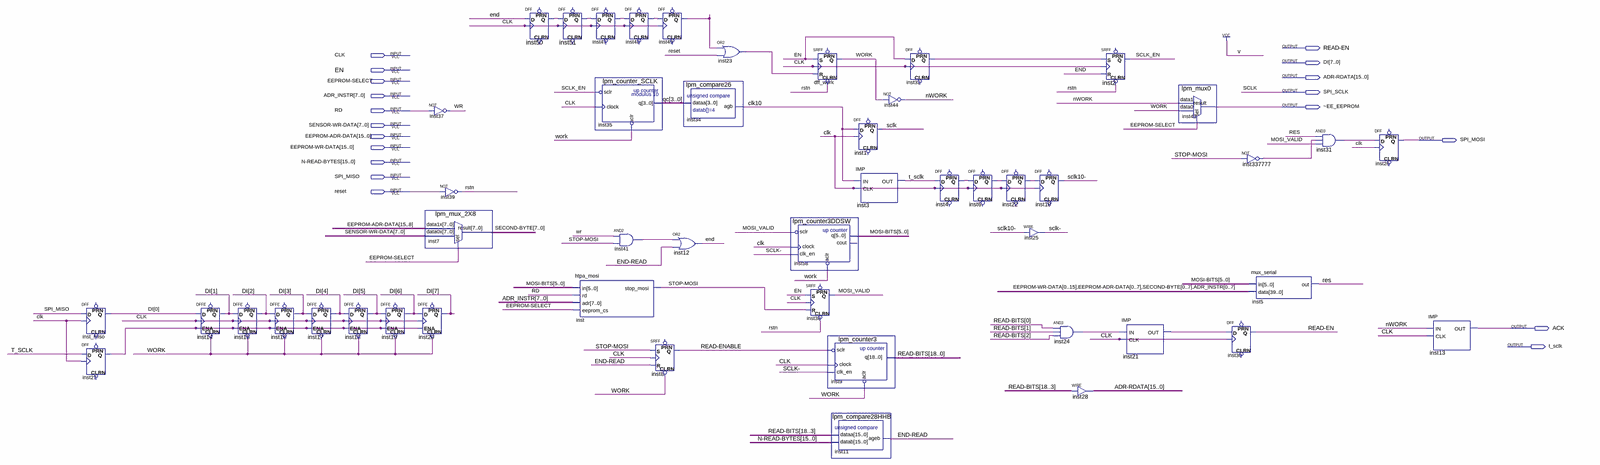
[diagram p0: schematic sheet, whole]
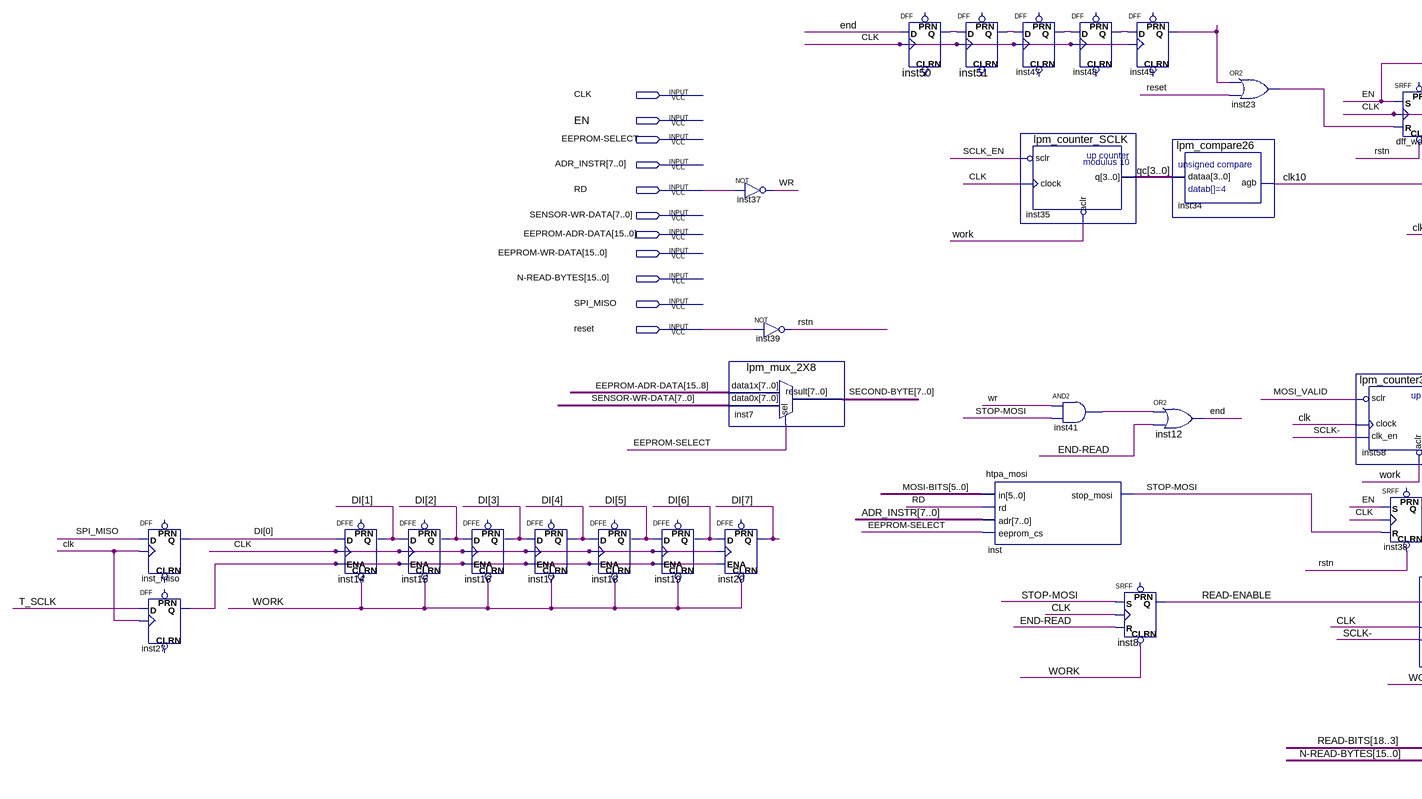
[diagram p1: schematic sheet, left part]
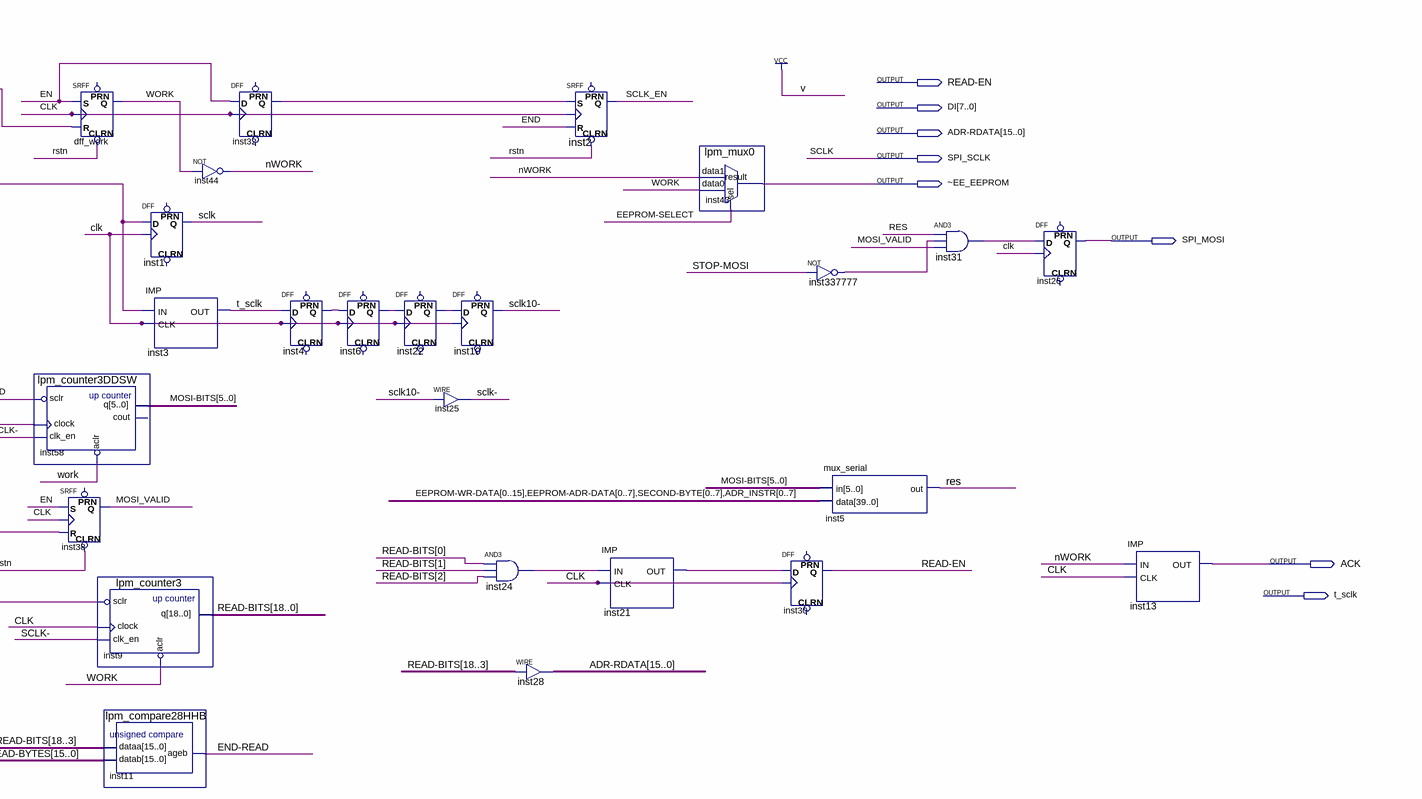
[diagram p2: schematic sheet, right part]
// Quartus schematic HTPA80x64d.bdf as structural Verilog: 49 symbols, 19 pins
module HTPA80x64d (
  input  CLK,
  input  EN,
  input  \EEPROM-SELECT ,
  input  [7:0] ADR_INSTR,
  input  RD,
  input  [7:0] \SENSOR-WR-DATA ,
  input  [15:0] \EEPROM-ADR-DATA ,
  input  [15:0] \EEPROM-WR-DATA ,
  input  [15:0] \N-READ-BYTES ,
  input  SPI_MISO,
  input  reset,
  output \READ-EN ,
  output [7:0] DI,
  output [15:0] \ADR-RDATA ,
  output SPI_SCLK,
  output \~EE_EEPROM ,
  output SPI_MOSI,
  output ACK,
  output t_sclk
);

  wire clk10, \end , \END-READ , inst4_q, inst6_q, inst21_out, inst22_q, inst23_out, inst24_out, inst27_q,
       inst31_out, inst32_q, inst41_out, inst47_q, inst48_q, inst49_q, inst50_q, inst51_q, inst337777_out,
       MOSI_VALID, nWORK, \READ-ENABLE , RES, rstn, \sclk10- , \SCLK- , SCLK_EN, \STOP-MOSI , WORK, wr;
  wire [3:0] qc;
  wire [5:0] \MOSI-BITS ;
  wire [7:0] \SECOND-BYTE ;
  wire [18:0] \READ-BITS ;

  DFF inst_miso (.CLK(CLK), .D(SPI_MISO), .Q(DI[0]));  // open: CLRN, PRN
  DFF inst27 (.CLK(CLK), .D(t_sclk), .Q(inst27_q));  // open: CLRN, PRN
  DFFE inst14 (.CLRN(WORK), .D(DI[0]), .CLK(CLK), .ENA(inst27_q), .Q(DI[1]));  // open: PRN
  DFFE inst15 (.CLRN(WORK), .D(DI[1]), .CLK(CLK), .ENA(inst27_q), .Q(DI[2]));  // open: PRN
  DFFE inst16 (.CLRN(WORK), .D(DI[2]), .CLK(CLK), .ENA(inst27_q), .Q(DI[3]));  // open: PRN
  DFFE inst17 (.CLRN(WORK), .D(DI[3]), .CLK(CLK), .ENA(inst27_q), .Q(DI[4]));  // open: PRN
  DFFE inst18 (.CLRN(WORK), .D(DI[4]), .CLK(CLK), .ENA(inst27_q), .Q(DI[5]));  // open: PRN
  DFFE inst19 (.CLRN(WORK), .D(DI[5]), .CLK(CLK), .ENA(inst27_q), .Q(DI[6]));  // open: PRN
  lpm_mux_2X8 inst7 (
    .data1x(\EEPROM-ADR-DATA [15:8]), .data0x(\SENSOR-WR-DATA ), .sel(\EEPROM-SELECT ), .result(\SECOND-BYTE ));
  DFFE inst20 (.CLRN(WORK), .D(DI[6]), .CLK(CLK), .ENA(inst27_q), .Q(DI[7]));  // open: PRN
  not inst37 (wr, RD);
  not inst39 (rstn, reset);
  DFF inst50 (.CLK(CLK), .D(\end ), .Q(inst50_q));  // open: CLRN, PRN
  DFF inst51 (.CLK(CLK), .D(inst50_q), .Q(inst51_q));  // open: CLRN, PRN
  htpa_mosi inst (.in(\MOSI-BITS ), .rd(RD), .adr(ADR_INSTR), .eeprom_cs(\EEPROM-SELECT ), .stop_mosi(\STOP-MOSI ));
  DFF inst47 (.CLK(CLK), .D(inst51_q), .Q(inst47_q));  // open: CLRN, PRN
  lpm_counter_SCLK inst35 (.sclr(~SCLK_EN), .clock(CLK), .aclr(~WORK), .q(qc));
  DFF inst48 (.CLK(CLK), .D(inst47_q), .Q(inst48_q));  // open: CLRN, PRN
  and inst41 (inst41_out, wr, \STOP-MOSI );
  DFF inst49 (.CLK(CLK), .D(inst48_q), .Q(inst49_q));  // open: CLRN, PRN
  SRFF inst8 (.CLRN(WORK), .S(\STOP-MOSI ), .R(\END-READ ), .CLK(CLK), .Q(\READ-ENABLE ));  // open: PRN
  lpm_compare26 inst34 (.dataa(qc), .agb(clk10));
  or inst12 (\end , inst41_out, \END-READ );
  or inst23 (inst23_out, inst49_q, reset);
  lpm_counter3DDSW inst58 (
    .sclr(~MOSI_VALID), .clock(CLK), .clk_en(\SCLK- ), .aclr(~WORK), .q(\MOSI-BITS ));  // open: cout
  SRFF inst38 (.CLRN(rstn), .S(EN), .R(\STOP-MOSI ), .CLK(CLK), .Q(MOSI_VALID));  // open: PRN
  SRFF dff_work (.CLRN(rstn), .S(EN), .R(inst23_out), .CLK(CLK), .Q(WORK));  // open: PRN
  lpm_counter3 inst9 (.sclr(~\READ-ENABLE ), .clock(CLK), .clk_en(\SCLK- ), .aclr(~WORK), .q(\READ-BITS ));
  lpm_compare28HHB inst11 (.dataa(\READ-BITS [18:3]), .datab(\N-READ-BYTES ), .ageb(\END-READ ));
  DFF inst1 (.CLK(CLK), .D(clk10), .Q(SPI_SCLK));  // open: CLRN, PRN
  IMP inst3 (.IN(clk10), .CLK(CLK), .OUT(t_sclk));
  not inst44 (nWORK, WORK);
  DFF inst32 (.CLK(CLK), .D(EN), .Q(inst32_q));  // open: CLRN, PRN
  DFF inst4 (.CLK(CLK), .D(t_sclk), .Q(inst4_q));  // open: CLRN, PRN
  DFF inst6 (.CLK(CLK), .D(inst4_q), .Q(inst6_q));  // open: CLRN, PRN
  DFF inst22 (.CLK(CLK), .D(inst6_q), .Q(inst22_q));  // open: CLRN, PRN
  DFF inst10 (.CLK(CLK), .D(inst22_q), .Q(\sclk10- ));  // open: CLRN, PRN
  assign \SCLK-  = \sclk10- ;  // WIRE inst25
  and inst24 (inst24_out, \READ-BITS [0], \READ-BITS [1], \READ-BITS [2]);
  assign \ADR-RDATA  = \READ-BITS [18:3];  // WIRE inst28
  SRFF inst2 (.CLRN(rstn), .S(inst32_q), .R(\end ), .CLK(CLK), .Q(SCLK_EN));  // open: PRN
  IMP inst21 (.IN(inst24_out), .CLK(CLK), .OUT(inst21_out));
  lpm_mux0 inst43 (.data1(nWORK), .data0(WORK), .sel(\EEPROM-SELECT ), .result(\~EE_EEPROM ));
  not inst337777 (inst337777_out, \STOP-MOSI );
  mux_serial inst5 (
    .in(\MOSI-BITS ),
    .data({\EEPROM-WR-DATA [0], \EEPROM-WR-DATA [1], \EEPROM-WR-DATA [2], \EEPROM-WR-DATA [3], \EEPROM-WR-DATA [4], \EEPROM-WR-DATA [5], \EEPROM-WR-DATA [6], \EEPROM-WR-DATA [7], \EEPROM-WR-DATA [8], \EEPROM-WR-DATA [9], \EEPROM-WR-DATA [10], \EEPROM-WR-DATA [11], \EEPROM-WR-DATA [12], \EEPROM-WR-DATA [13], \EEPROM-WR-DATA [14], \EEPROM-WR-DATA [15], \EEPROM-ADR-DATA [0], \EEPROM-ADR-DATA [1], \EEPROM-ADR-DATA [2], \EEPROM-ADR-DATA [3], \EEPROM-ADR-DATA [4], \EEPROM-ADR-DATA [5], \EEPROM-ADR-DATA [6], \EEPROM-ADR-DATA [7], \SECOND-BYTE [0], \SECOND-BYTE [1], \SECOND-BYTE [2], \SECOND-BYTE [3], \SECOND-BYTE [4], \SECOND-BYTE [5], \SECOND-BYTE [6], \SECOND-BYTE [7], ADR_INSTR[0], ADR_INSTR[1], ADR_INSTR[2], ADR_INSTR[3], ADR_INSTR[4], ADR_INSTR[5], ADR_INSTR[6], ADR_INSTR[7]}),
    .out(RES));
  DFF inst30 (.CLK(CLK), .D(inst21_out), .Q(\READ-EN ));  // open: CLRN, PRN
  and inst31 (inst31_out, RES, inst337777_out, MOSI_VALID);
  DFF inst26 (.CLK(CLK), .D(inst31_out), .Q(SPI_MOSI));  // open: CLRN, PRN
  IMP inst13 (.IN(nWORK), .CLK(CLK), .OUT(ACK));

  // Other names for the same wires on the sheet: SCLK = SPI_SCLK
endmodule
